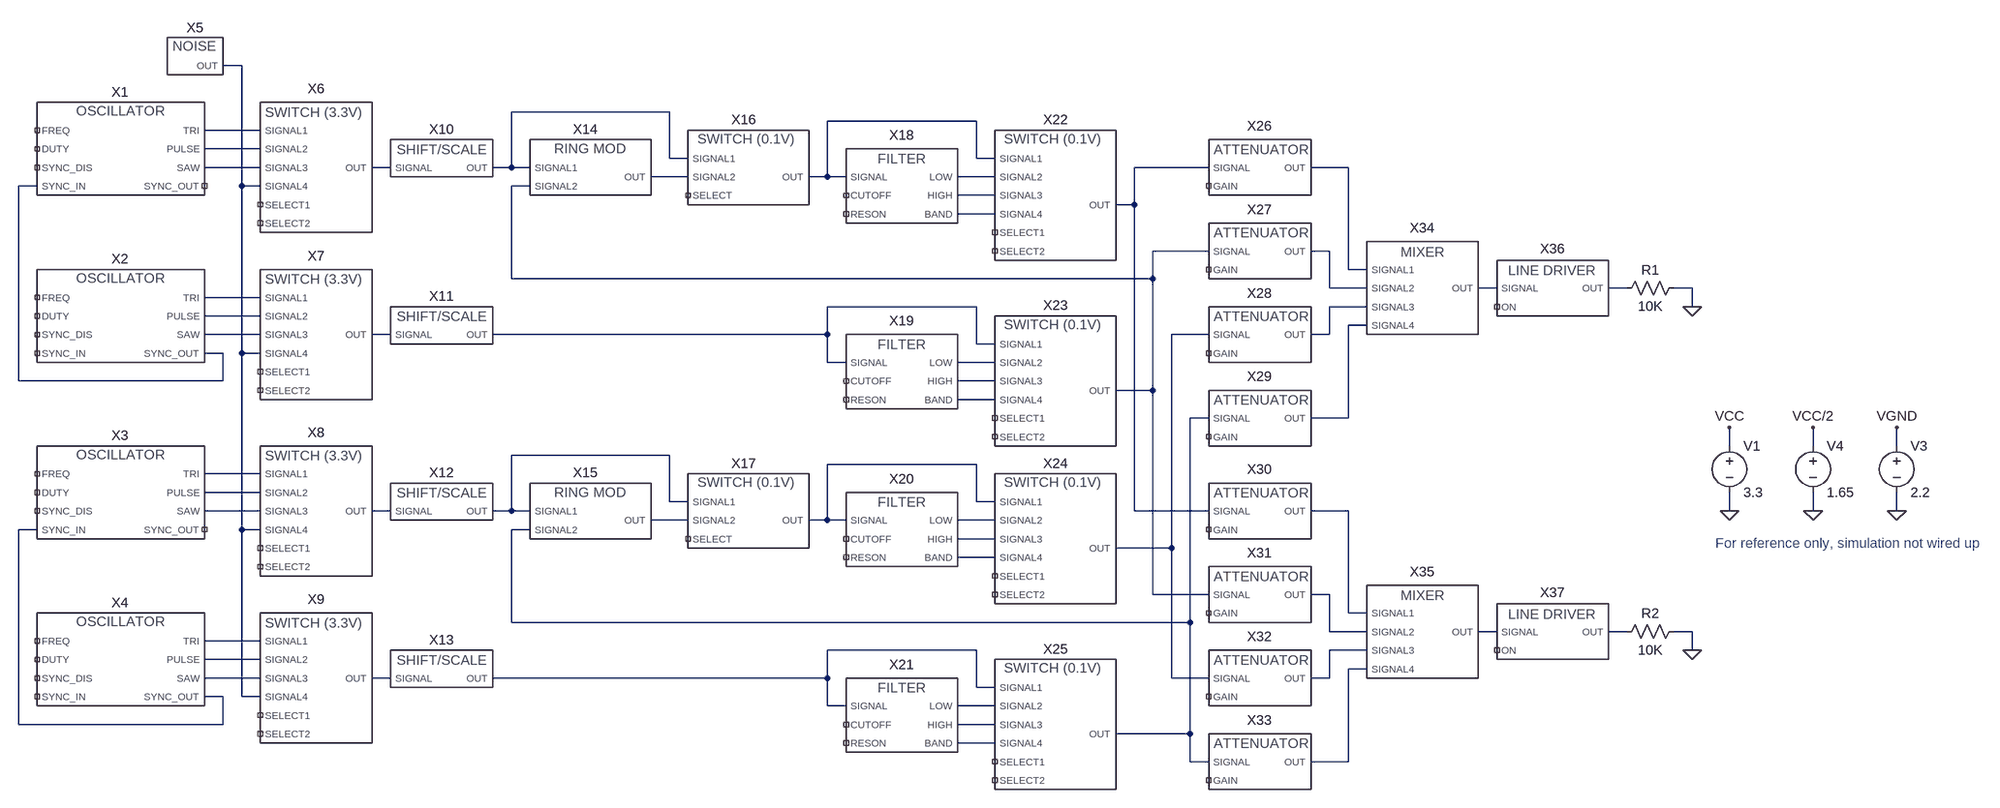
[diagram p0: schematic test_toplevel.asc]
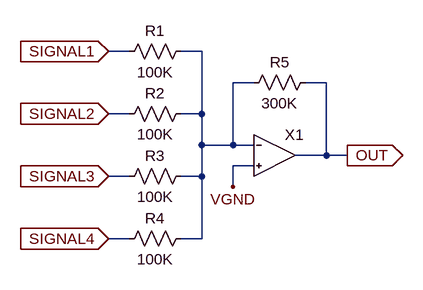
[diagram p1: sub-circuit mixer.asc]
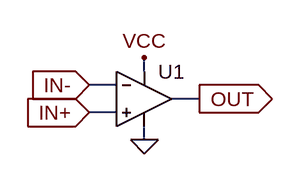
[diagram p2: sub-circuit opamp.asc]
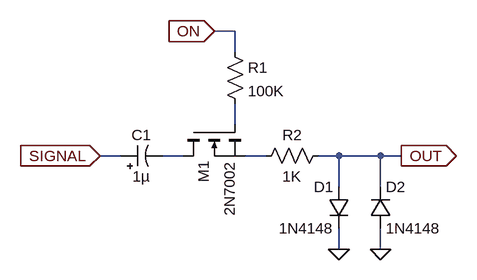
[diagram p3: sub-circuit line_driver.asc]
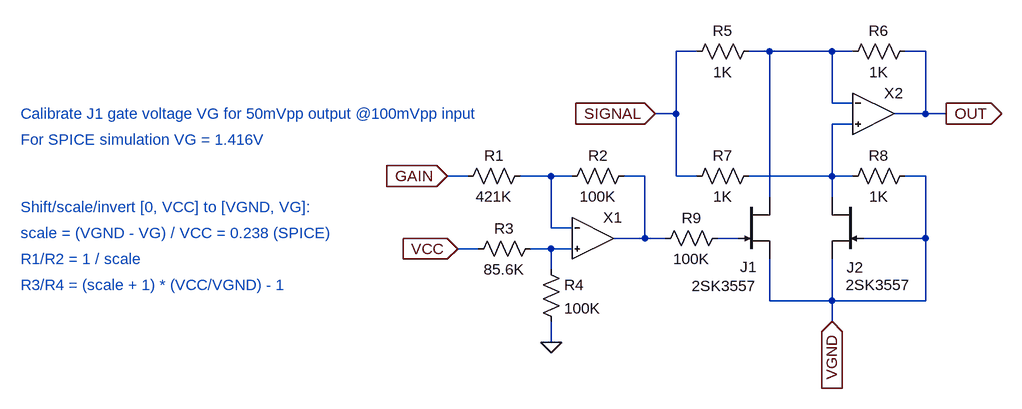
[diagram p4: sub-circuit attenuator.asc]
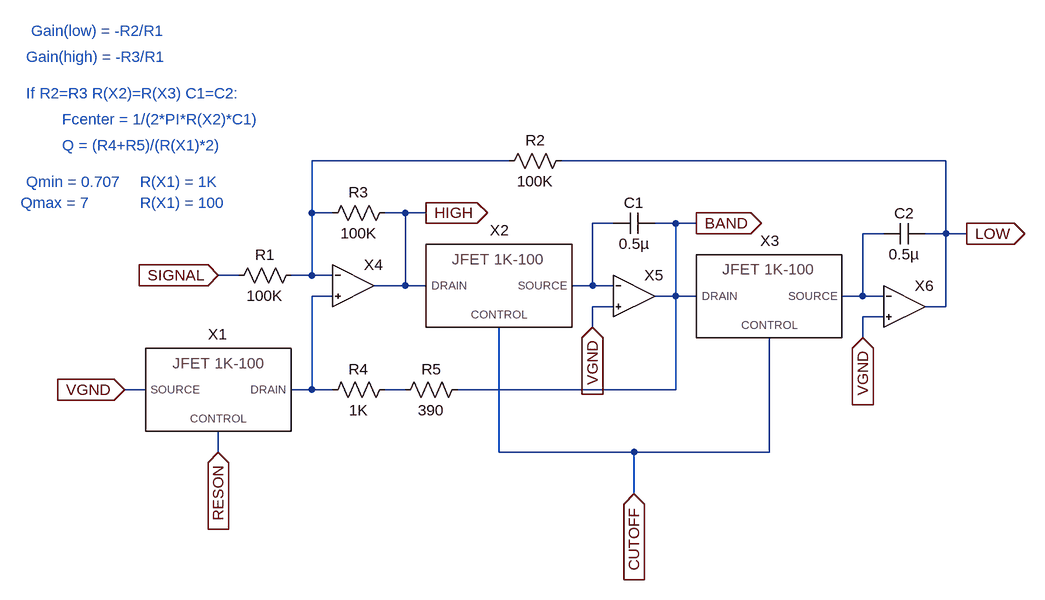
[diagram p5: sub-circuit filter.asc]
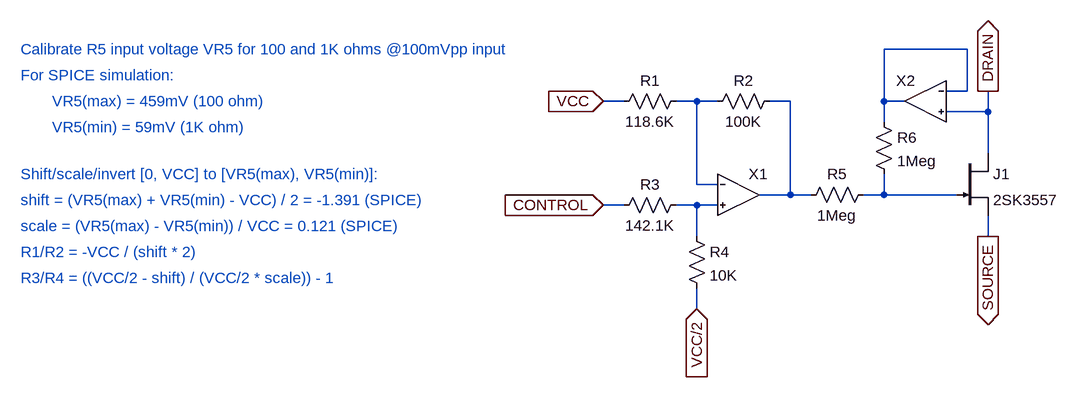
[diagram p6: sub-circuit jfet_1k_100.asc]
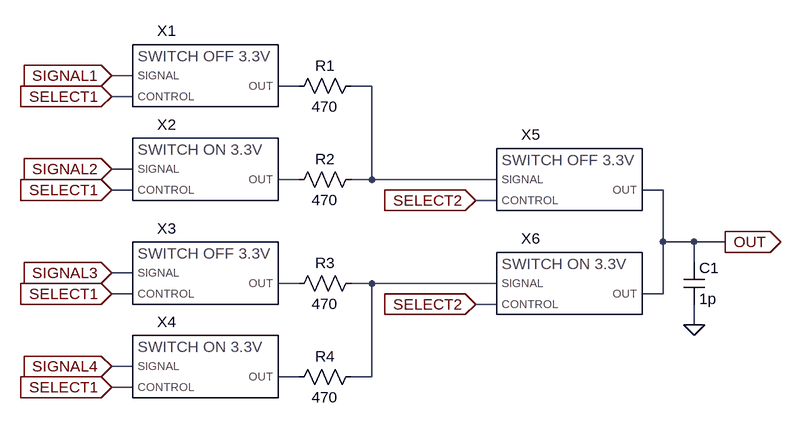
[diagram p7: sub-circuit switch4_3.3v.asc]
test_toplevel.asc, the LTspice schematic file:
Version 4
SHEET 1 1800 896
WIRE -1504 -624 -1536 -624
WIRE -768 -544 -1040 -544
WIRE -240 -528 -496 -528
WIRE -1472 -512 -1568 -512
WIRE -1472 -480 -1568 -480
WIRE -768 -464 -768 -544
WIRE -736 -464 -768 -464
WIRE -240 -464 -240 -528
WIRE -208 -464 -240 -464
WIRE -1472 -448 -1568 -448
WIRE -1248 -448 -1280 -448
WIRE -1040 -448 -1040 -544
WIRE -1040 -448 -1072 -448
WIRE -1008 -448 -1040 -448
WIRE 160 -448 32 -448
WIRE 400 -448 336 -448
WIRE -736 -432 -800 -432
WIRE -496 -432 -496 -528
WIRE -496 -432 -528 -432
WIRE -464 -432 -496 -432
WIRE -208 -432 -272 -432
WIRE -1856 -416 -1888 -416
WIRE -1504 -416 -1504 -624
WIRE -1472 -416 -1504 -416
WIRE -1008 -416 -1040 -416
WIRE -208 -400 -272 -400
WIRE 32 -384 32 -448
WIRE 32 -384 0 -384
WIRE -208 -368 -272 -368
WIRE 160 -304 64 -304
WIRE 368 -304 336 -304
WIRE 400 -272 400 -448
WIRE 432 -272 400 -272
WIRE -1040 -256 -1040 -416
WIRE 64 -256 64 -304
WIRE 64 -256 -1040 -256
WIRE 368 -240 368 -304
WIRE 432 -240 368 -240
WIRE 656 -240 624 -240
WIRE 880 -240 848 -240
WIRE 992 -240 960 -240
WIRE -1472 -224 -1568 -224
WIRE -240 -208 -496 -208
WIRE 432 -208 368 -208
WIRE 992 -208 992 -240
WIRE -1472 -192 -1568 -192
WIRE 432 -176 400 -176
WIRE -1472 -160 -1568 -160
WIRE -1248 -160 -1280 -160
WIRE -496 -160 -496 -208
WIRE -496 -160 -1072 -160
WIRE 160 -160 96 -160
WIRE 368 -160 368 -208
WIRE 368 -160 336 -160
WIRE -240 -144 -240 -208
WIRE -208 -144 -240 -144
WIRE -1536 -128 -1568 -128
WIRE -1504 -128 -1504 -416
WIRE -1472 -128 -1504 -128
WIRE -496 -112 -496 -160
WIRE -464 -112 -496 -112
WIRE -208 -112 -272 -112
WIRE -1888 -80 -1888 -416
WIRE -1536 -80 -1536 -128
WIRE -1536 -80 -1888 -80
WIRE -208 -80 -272 -80
WIRE 64 -64 64 -256
WIRE 64 -64 0 -64
WIRE -208 -48 -272 -48
WIRE 160 -16 128 -16
WIRE 400 -16 400 -176
WIRE 400 -16 336 -16
WIRE 1056 32 1056 0
WIRE 1200 32 1200 0
WIRE 1344 32 1344 0
WIRE -768 48 -1040 48
WIRE -240 64 -496 64
WIRE -1472 80 -1568 80
WIRE -1472 112 -1568 112
WIRE -768 128 -768 48
WIRE -736 128 -768 128
WIRE -240 128 -240 64
WIRE -208 128 -240 128
WIRE -1472 144 -1568 144
WIRE -1248 144 -1280 144
WIRE -1040 144 -1040 48
WIRE -1040 144 -1072 144
WIRE -1008 144 -1040 144
WIRE 32 144 32 -384
WIRE 160 144 32 144
WIRE 400 144 336 144
WIRE 1056 144 1056 112
WIRE 1200 144 1200 112
WIRE 1344 144 1344 112
WIRE -736 160 -800 160
WIRE -496 160 -496 64
WIRE -496 160 -528 160
WIRE -464 160 -496 160
WIRE -208 160 -272 160
WIRE -1856 176 -1888 176
WIRE -1504 176 -1504 -128
WIRE -1472 176 -1504 176
WIRE -1008 176 -1040 176
WIRE -208 192 -272 192
WIRE 96 208 96 -160
WIRE 96 208 0 208
WIRE -208 224 -272 224
WIRE 64 288 64 -64
WIRE 160 288 64 288
WIRE 368 288 336 288
WIRE 400 320 400 144
WIRE 432 320 400 320
WIRE -1040 336 -1040 176
WIRE 128 336 128 -16
WIRE 128 336 -1040 336
WIRE 368 352 368 288
WIRE 432 352 368 352
WIRE 656 352 624 352
WIRE 880 352 848 352
WIRE 992 352 960 352
WIRE -1472 368 -1568 368
WIRE -240 384 -496 384
WIRE 432 384 368 384
WIRE 992 384 992 352
WIRE -1472 400 -1568 400
WIRE 432 416 400 416
WIRE -1472 432 -1568 432
WIRE -1248 432 -1280 432
WIRE -496 432 -496 384
WIRE -496 432 -1072 432
WIRE 96 432 96 208
WIRE 160 432 96 432
WIRE 368 432 368 384
WIRE 368 432 336 432
WIRE -240 448 -240 384
WIRE -208 448 -240 448
WIRE -1536 464 -1568 464
WIRE -1504 464 -1504 176
WIRE -1472 464 -1504 464
WIRE -496 480 -496 432
WIRE -464 480 -496 480
WIRE -208 480 -272 480
WIRE -1888 512 -1888 176
WIRE -1536 512 -1536 464
WIRE -1536 512 -1888 512
WIRE -208 512 -272 512
WIRE 128 528 128 336
WIRE 128 528 0 528
WIRE -208 544 -272 544
WIRE 128 576 128 528
WIRE 160 576 128 576
WIRE 400 576 400 416
WIRE 400 576 336 576
FLAG 1056 144 0
FLAG 1056 0 VCC
FLAG 1344 144 0
FLAG 1344 0 VGND
FLAG 992 -208 0
FLAG 992 384 0
FLAG 1200 144 0
FLAG 1200 0 VCC/2
SYMBOL voltage 1056 16 R0
WINDOW 123 0 0 Left 0
WINDOW 39 0 0 Left 0
SYMATTR InstName V1
SYMATTR Value 3.3
SYMBOL voltage 1344 16 R0
WINDOW 123 0 0 Left 0
WINDOW 39 0 0 Left 0
SYMATTR InstName V3
SYMATTR Value 2.2
SYMBOL res 976 -256 R90
WINDOW 0 0 56 VBottom 2
WINDOW 3 32 56 VTop 2
SYMATTR InstName R1
SYMATTR Value 10K
SYMBOL mixer 528 -208 R0
SYMATTR InstName X34
SYMBOL res 976 336 R90
WINDOW 0 0 56 VBottom 2
WINDOW 3 32 56 VTop 2
SYMATTR InstName R2
SYMATTR Value 10K
SYMBOL line_driver 752 -272 R0
SYMATTR InstName X36
SYMBOL line_driver 752 320 R0
SYMATTR InstName X37
SYMBOL voltage 1200 16 R0
WINDOW 123 0 0 Left 0
WINDOW 39 0 0 Left 0
SYMATTR InstName V4
SYMATTR Value 1.65
SYMBOL attenuator 240 -464 R0
SYMATTR InstName X26
SYMBOL attenuator 240 -320 R0
SYMATTR InstName X27
SYMBOL attenuator 240 -176 R0
SYMATTR InstName X28
SYMBOL attenuator 240 -32 R0
SYMATTR InstName X29
SYMBOL mixer 528 384 R0
SYMATTR InstName X35
SYMBOL attenuator 240 128 R0
SYMATTR InstName X30
SYMBOL attenuator 240 272 R0
SYMATTR InstName X31
SYMBOL attenuator 240 416 R0
SYMATTR InstName X32
SYMBOL attenuator 240 560 R0
SYMATTR InstName X33
SYMBOL filter -368 -400 R0
SYMATTR InstName X18
SYMBOL filter -368 -80 R0
SYMATTR InstName X19
SYMBOL filter -368 192 R0
SYMATTR InstName X20
SYMBOL filter -368 512 R0
SYMATTR InstName X21
SYMBOL switch4_3.3v -1376 -480 R0
SYMATTR InstName X6
SYMBOL switch4_3.3v -1376 -192 R0
SYMATTR InstName X7
SYMBOL switch4_3.3v -1376 112 R0
SYMATTR InstName X8
SYMBOL switch4_3.3v -1376 400 R0
SYMATTR InstName X9
SYMBOL oscillator -1792 -512 R0
SYMATTR InstName X1
SYMBOL oscillator -1792 -224 R0
SYMATTR InstName X2
SYMBOL oscillator -1792 80 R0
SYMATTR InstName X3
SYMBOL oscillator -1792 368 R0
SYMATTR InstName X4
SYMBOL noise -1536 -624 R0
SYMATTR InstName X5
SYMBOL shift_scale -1184 -496 R0
SYMATTR InstName X10
SYMBOL shift_scale -1184 -208 R0
SYMATTR InstName X11
SYMBOL shift_scale -1184 96 R0
SYMATTR InstName X12
SYMBOL shift_scale -1184 384 R0
SYMATTR InstName X13
SYMBOL ring_modulator -992 -448 R0
SYMATTR InstName X14
SYMBOL ring_modulator -992 144 R0
SYMATTR InstName X15
SYMBOL switch2_0.1v -704 -464 R0
SYMATTR InstName X16
SYMBOL switch2_0.1v -704 128 R0
SYMATTR InstName X17
SYMBOL switch4_0.1v -176 -464 R0
SYMATTR InstName X22
SYMBOL switch4_0.1v -176 -144 R0
SYMATTR InstName X23
SYMBOL switch4_0.1v -176 128 R0
SYMATTR InstName X24
SYMBOL switch4_0.1v -176 448 R0
SYMATTR InstName X25
TEXT 1032 200 Left 2 ;For reference only, simulation not wired up

mixer.asc, the sub-circuit schematic file:
Version 4
SHEET 1 880 680
WIRE 128 16 96 16
WIRE 240 16 208 16
WIRE 320 64 288 64
WIRE 432 64 400 64
WIRE 128 112 96 112
WIRE 240 112 240 16
WIRE 240 112 208 112
WIRE 240 160 240 112
WIRE 288 160 288 64
WIRE 288 160 240 160
WIRE 320 160 288 160
WIRE 432 176 432 64
WIRE 432 176 384 176
WIRE 464 176 432 176
WIRE 320 192 288 192
WIRE 128 208 96 208
WIRE 240 208 240 160
WIRE 240 208 208 208
WIRE 288 224 288 192
WIRE 128 304 96 304
WIRE 240 304 240 208
WIRE 240 304 208 304
FLAG 96 16 SIGNAL1
IOPIN 96 16 In
FLAG 96 112 SIGNAL2
IOPIN 96 112 In
FLAG 96 208 SIGNAL3
IOPIN 96 208 In
FLAG 96 304 SIGNAL4
IOPIN 96 304 In
FLAG 288 224 VGND
FLAG 464 176 OUT
IOPIN 464 176 Out
SYMBOL res 224 0 R90
WINDOW 0 0 56 VBottom 2
WINDOW 3 32 56 VTop 2
SYMATTR InstName R1
SYMATTR Value 100K
SYMBOL res 224 96 R90
WINDOW 0 0 56 VBottom 2
WINDOW 3 32 56 VTop 2
SYMATTR InstName R2
SYMATTR Value 100K
SYMBOL res 224 192 R90
WINDOW 0 0 56 VBottom 2
WINDOW 3 32 56 VTop 2
SYMATTR InstName R3
SYMATTR Value 100K
SYMBOL res 224 288 R90
WINDOW 0 0 56 VBottom 2
WINDOW 3 32 56 VTop 2
SYMATTR InstName R4
SYMATTR Value 100K
SYMBOL opamp 352 176 R0
SYMATTR InstName X1
SYMBOL res 416 48 R90
WINDOW 0 0 56 VBottom 2
WINDOW 3 32 56 VTop 2
SYMATTR InstName R5
SYMATTR Value 300K

opamp.asc, the sub-circuit schematic file:
Version 4
SHEET 1 880 680
WIRE 144 144 144 128
WIRE 112 160 80 160
WIRE 208 176 176 176
WIRE 112 192 80 192
WIRE 144 224 144 208
FLAG 144 224 0
FLAG 144 128 VCC
FLAG 208 176 OUT
IOPIN 208 176 Out
FLAG 80 192 IN+
IOPIN 80 192 In
FLAG 80 160 IN-
IOPIN 80 160 In
SYMBOL Opamps\\UniversalOpamp2 144 176 R0
SYMATTR InstName U1
SYMATTR Value2 Avol=1Meg GBW=1.2Meg Slew=10Meg

line_driver.asc, the sub-circuit schematic file:
Version 4
SHEET 1 880 680
WIRE -16 -80 -48 -80
WIRE -16 -48 -16 -80
WIRE -16 64 -16 32
WIRE -192 112 -224 112
WIRE -96 112 -128 112
WIRE 32 112 0 112
WIRE 144 112 112 112
WIRE 208 112 144 112
WIRE 240 112 208 112
WIRE 144 160 144 112
WIRE 208 160 208 112
WIRE 144 256 144 224
WIRE 208 256 208 224
FLAG 144 256 0
FLAG 208 256 0
FLAG 240 112 OUT
IOPIN 240 112 Out
FLAG -224 112 SIGNAL
IOPIN -224 112 In
FLAG -48 -80 ON
IOPIN -48 -80 In
SYMBOL res 128 96 R90
WINDOW 0 0 56 VBottom 2
WINDOW 3 32 56 VTop 2
SYMATTR InstName R2
SYMATTR Value 1K
SYMBOL diode 160 160 M0
SYMATTR InstName D1
SYMATTR Value 1N4148
SYMBOL diode 192 224 M180
WINDOW 0 24 64 Left 2
WINDOW 3 24 0 Left 2
SYMATTR InstName D2
SYMATTR Value 1N4148
SYMBOL polcap -192 128 R270
WINDOW 0 32 32 VTop 2
WINDOW 3 0 32 VBottom 2
SYMATTR InstName C1
SYMATTR Value 1µ
SYMBOL res -32 -64 R0
SYMATTR InstName R1
SYMATTR Value 100K
SYMBOL nmos -96 64 M90
SYMATTR InstName M1
SYMATTR Value 2N7002

attenuator.asc, the sub-circuit schematic file:
Version 4
SHEET 1 1100 728
WIRE -96 80 -128 80
WIRE 16 80 -16 80
WIRE 112 80 16 80
WIRE 144 80 112 80
WIRE 256 80 224 80
WIRE 112 160 112 80
WIRE 144 160 112 160
WIRE -128 176 -128 80
WIRE -128 176 -160 176
WIRE 256 176 256 80
WIRE 256 176 208 176
WIRE 288 176 256 176
WIRE 144 192 112 192
WIRE -448 272 -480 272
WIRE -320 272 -368 272
WIRE -288 272 -320 272
WIRE -176 272 -208 272
WIRE -128 272 -128 176
WIRE -96 272 -128 272
WIRE 112 272 112 192
WIRE 112 272 -16 272
WIRE 144 272 112 272
WIRE 256 272 224 272
WIRE 16 304 16 80
WIRE 112 304 112 272
WIRE -320 352 -320 272
WIRE -288 352 -320 352
WIRE -176 368 -176 272
WIRE -176 368 -224 368
WIRE -144 368 -176 368
WIRE -32 368 -64 368
WIRE 256 368 256 272
WIRE 256 368 160 368
WIRE -432 384 -464 384
WIRE -320 384 -352 384
WIRE -288 384 -320 384
WIRE -320 416 -320 384
WIRE 16 464 16 400
WIRE 112 464 112 400
WIRE 112 464 16 464
WIRE 256 464 256 368
WIRE 256 464 112 464
WIRE 112 496 112 464
WIRE -320 528 -320 496
FLAG 288 176 OUT
IOPIN 288 176 Out
FLAG -160 176 SIGNAL
IOPIN -160 176 In
FLAG -320 528 0
FLAG -480 272 GAIN
IOPIN -480 272 In
FLAG 112 496 VGND
IOPIN 112 496 In
FLAG -464 384 VCC
IOPIN -464 384 In
SYMBOL res 240 64 R90
WINDOW 0 0 56 VBottom 2
WINDOW 3 32 56 VTop 2
SYMATTR InstName R6
SYMATTR Value 1K
SYMBOL res 240 256 R90
WINDOW 0 0 56 VBottom 2
WINDOW 3 32 56 VTop 2
SYMATTR InstName R8
SYMATTR Value 1K
SYMBOL njf 160 304 M0
WINDOW 0 0 109 Left 2
WINDOW 3 -72 136 Left 2
SYMATTR InstName J2
SYMATTR Value 2SK3557
SYMBOL njf -32 304 R0
WINDOW 0 3 108 Left 2
WINDOW 3 -72 137 Left 2
SYMATTR InstName J1
SYMATTR Value 2SK3557
SYMBOL res 0 64 R90
WINDOW 0 0 56 VBottom 2
WINDOW 3 32 56 VTop 2
SYMATTR InstName R5
SYMATTR Value 1K
SYMBOL res 0 256 R90
WINDOW 0 0 56 VBottom 2
WINDOW 3 32 56 VTop 2
SYMATTR InstName R7
SYMATTR Value 1K
SYMBOL res -48 352 R90
WINDOW 0 0 56 VBottom 2
WINDOW 3 32 56 VTop 2
SYMATTR InstName R9
SYMATTR Value 100K
SYMBOL res -336 400 R0
SYMATTR InstName R4
SYMATTR Value 100K
SYMBOL res -336 368 R90
WINDOW 0 0 56 VBottom 2
WINDOW 3 32 56 VTop 2
SYMATTR InstName R3
SYMATTR Value 85.6K
SYMBOL res -192 256 R90
WINDOW 0 0 56 VBottom 2
WINDOW 3 32 56 VTop 2
SYMATTR InstName R2
SYMATTR Value 100K
SYMBOL res -352 256 R90
WINDOW 0 0 56 VBottom 2
WINDOW 3 32 56 VTop 2
SYMATTR InstName R1
SYMATTR Value 421K
SYMBOL opamp 176 176 R0
SYMATTR InstName X2
SYMBOL opamp -256 368 R0
SYMATTR InstName X1
TEXT -1136 176 Left 2 ;Calibrate J1 gate voltage VG for 50mVpp output @100mVpp input
TEXT -1136 320 Left 2 ;Shift/scale/invert [0, VCC] to [VGND, VG]:
TEXT -1136 216 Left 2 ;For SPICE simulation VG = 1.416V
TEXT -1136 360 Left 2 ;scale = (VGND - VG) / VCC = 0.238 (SPICE)
TEXT -1136 400 Left 2 ;R1/R2 = 1 / scale
TEXT -1136 440 Left 2 ;R3/R4 = (scale + 1) * (VCC/VGND) - 1

filter.asc, the sub-circuit schematic file:
Version 4
SHEET 1 1624 1400
WIRE 96 48 -208 48
WIRE 768 48 176 48
WIRE -208 128 -208 48
WIRE -176 128 -208 128
WIRE -64 128 -96 128
WIRE -32 128 -64 128
WIRE 256 144 224 144
WIRE 352 144 320 144
WIRE 384 144 352 144
WIRE 672 160 640 160
WIRE 768 160 768 48
WIRE 768 160 736 160
WIRE 800 160 768 160
WIRE -320 224 -352 224
WIRE -208 224 -208 128
WIRE -208 224 -240 224
WIRE -176 224 -208 224
WIRE -64 240 -64 128
WIRE -64 240 -112 240
WIRE -32 240 -64 240
WIRE 224 240 224 144
WIRE 224 240 192 240
WIRE 256 240 224 240
WIRE -176 256 -208 256
WIRE 352 256 352 144
WIRE 352 256 320 256
WIRE 384 256 352 256
WIRE 640 256 640 160
WIRE 640 256 608 256
WIRE 672 256 640 256
WIRE 256 272 224 272
WIRE 768 272 768 160
WIRE 768 272 736 272
WIRE 672 288 640 288
WIRE 224 304 224 272
WIRE 640 320 640 288
WIRE -464 400 -496 400
WIRE -208 400 -208 256
WIRE -208 400 -240 400
WIRE -176 400 -208 400
WIRE -64 400 -96 400
WIRE 352 400 352 256
WIRE 352 400 16 400
WIRE -352 496 -352 464
WIRE 80 496 80 304
WIRE 288 496 80 496
WIRE 496 496 496 320
WIRE 496 496 288 496
WIRE 288 560 288 496
FLAG -352 224 SIGNAL
IOPIN -352 224 In
FLAG 224 304 VGND
IOPIN 224 304 In
FLAG 640 320 VGND
IOPIN 640 320 In
FLAG -32 128 HIGH
IOPIN -32 128 Out
FLAG 384 144 BAND
IOPIN 384 144 Out
FLAG 800 160 LOW
IOPIN 800 160 Out
FLAG -496 400 VGND
IOPIN -496 400 In
FLAG -352 496 RESON
IOPIN -352 496 In
FLAG 288 560 CUTOFF
IOPIN 288 560 In
SYMBOL cap 320 128 R90
WINDOW 0 0 32 VBottom 2
WINDOW 3 32 32 VTop 2
SYMATTR InstName C1
SYMATTR Value 0.5µ
SYMBOL cap 736 144 R90
WINDOW 0 0 32 VBottom 2
WINDOW 3 32 32 VTop 2
SYMATTR InstName C2
SYMATTR Value 0.5µ
SYMBOL res -80 112 R90
WINDOW 0 0 56 VBottom 2
WINDOW 3 32 56 VTop 2
SYMATTR InstName R3
SYMATTR Value 100K
SYMBOL res 192 32 R90
WINDOW 0 0 56 VBottom 2
WINDOW 3 32 56 VTop 2
SYMATTR InstName R2
SYMATTR Value 100K
SYMBOL res -224 208 R90
WINDOW 0 0 56 VBottom 2
WINDOW 3 32 56 VTop 2
SYMATTR InstName R1
SYMATTR Value 100K
SYMBOL opamp -144 240 R0
SYMATTR InstName X4
SYMBOL opamp 288 256 R0
SYMATTR InstName X5
SYMBOL opamp 704 272 R0
SYMATTR InstName X6
SYMBOL res -80 384 R90
WINDOW 0 0 56 VBottom 2
WINDOW 3 32 56 VTop 2
SYMATTR InstName R4
SYMATTR Value 1K
SYMBOL jfet_1k_100 -352 400 M0
SYMATTR InstName X1
SYMBOL jfet_1k_100 80 240 R0
SYMATTR InstName X2
SYMBOL jfet_1k_100 496 256 R0
SYMATTR InstName X3
SYMBOL res 32 384 R90
WINDOW 0 0 56 VBottom 2
WINDOW 3 32 56 VTop 2
SYMATTR InstName R5
SYMATTR Value 390
TEXT -640 -152 Left 2 ;Gain(low) = -R2/R1
TEXT -648 -112 Left 2 ;Gain(high) = -R3/R1
TEXT -648 -56 Left 2 ;If R2=R3 R(X2)=R(X3) C1=C2:
TEXT -592 -16 Left 2 ;Fcenter = 1/(2*PI*R(X2)*C1)
TEXT -592 24 Left 2 ;Q = (R4+R5)/(R(X1)*2)
TEXT -648 80 Left 2 ;Qmin = 0.707
TEXT -656 112 Left 2 ;Qmax = 7
TEXT -472 80 Left 2 ;R(X1) = 1K
TEXT -472 112 Left 2 ;R(X1) = 100

jfet_1k_100.asc, the sub-circuit schematic file:
Version 4
SHEET 1 1080 680
WIRE 352 -256 224 -256
WIRE 352 -192 352 -256
WIRE 352 -192 320 -192
WIRE -176 -176 -208 -176
WIRE -64 -176 -96 -176
WIRE -32 -176 -64 -176
WIRE 80 -176 48 -176
WIRE 224 -176 224 -256
WIRE 256 -176 224 -176
WIRE 384 -160 384 -192
WIRE 384 -160 320 -160
WIRE 224 -144 224 -176
WIRE 384 -96 384 -160
WIRE -64 -48 -64 -176
WIRE -32 -48 -64 -48
WIRE 80 -32 80 -176
WIRE 80 -32 32 -32
WIRE 112 -32 80 -32
WIRE 224 -32 224 -64
WIRE 224 -32 192 -32
WIRE 336 -32 224 -32
WIRE -176 -16 -208 -16
WIRE -64 -16 -96 -16
WIRE -32 -16 -64 -16
WIRE -64 32 -64 -16
WIRE 384 32 384 0
WIRE -64 144 -64 112
FLAG -208 -16 CONTROL
IOPIN -208 -16 In
FLAG 384 32 SOURCE
IOPIN 384 32 Out
FLAG 384 -192 DRAIN
IOPIN 384 -192 Out
FLAG -208 -176 VCC
IOPIN -208 -176 In
FLAG -64 144 VCC/2
IOPIN -64 144 In
SYMBOL res -80 -192 R90
WINDOW 0 0 56 VBottom 2
WINDOW 3 32 56 VTop 2
SYMATTR InstName R1
SYMATTR Value 118.6K
SYMBOL res 64 -192 R90
WINDOW 0 0 56 VBottom 2
WINDOW 3 32 56 VTop 2
SYMATTR InstName R2
SYMATTR Value 100K
SYMBOL res -80 -32 R90
WINDOW 0 0 56 VBottom 2
WINDOW 3 32 56 VTop 2
SYMATTR InstName R3
SYMATTR Value 142.1K
SYMBOL res -80 16 R0
SYMATTR InstName R4
SYMATTR Value 10K
SYMBOL res 208 -48 R90
WINDOW 0 0 56 VBottom 2
WINDOW 3 32 56 VTop 2
SYMATTR InstName R5
SYMATTR Value 1Meg
SYMBOL njf 336 -96 R0
SYMATTR InstName J1
SYMATTR Value 2SK3557
SYMBOL res 208 -160 R0
SYMATTR InstName R6
SYMATTR Value 1Meg
SYMBOL opamp 0 -32 R0
SYMATTR InstName X1
SYMBOL opamp 288 -176 M0
SYMATTR InstName X2
TEXT -1104 -256 Left 2 ;Calibrate R5 input voltage VR5 for 100 and 1K ohms @100mVpp input
TEXT -1104 -216 Left 2 ;For SPICE simulation:
TEXT -1104 -24 Left 2 ;shift = (VR5(max) + VR5(min) - VCC) / 2 = -1.391 (SPICE)
TEXT -1104 -64 Left 2 ;Shift/scale/invert [0, VCC] to [VR5(max), VR5(min)]:
TEXT -1104 16 Left 2 ;scale = (VR5(max) - VR5(min)) / VCC = 0.121 (SPICE)
TEXT -1104 56 Left 2 ;R1/R2 = -VCC / (shift * 2)
TEXT -1104 96 Left 2 ;R3/R4 = ((VCC/2 - shift) / (VCC/2 * scale)) - 1
TEXT -1056 -176 Left 2 ;VR5(max) = 459mV (100 ohm)
TEXT -1056 -136 Left 2 ;VR5(min) = 59mV (1K ohm)

switch4_3.3v.asc, the sub-circuit schematic file:
Version 4
SHEET 1 1148 712
WIRE 80 160 48 160
WIRE 336 176 304 176
WIRE 448 176 416 176
WIRE 80 192 48 192
WIRE 80 304 48 304
WIRE 336 320 304 320
WIRE 448 320 448 176
WIRE 448 320 416 320
WIRE 640 320 448 320
WIRE 80 336 48 336
WIRE 896 336 864 336
WIRE 640 352 608 352
WIRE 896 416 896 336
WIRE 944 416 896 416
WIRE 992 416 944 416
WIRE 944 448 944 416
WIRE 80 464 48 464
WIRE 336 480 304 480
WIRE 448 480 416 480
WIRE 640 480 448 480
WIRE 80 496 48 496
WIRE 896 496 896 416
WIRE 896 496 864 496
WIRE 640 512 608 512
WIRE 944 544 944 512
WIRE 80 608 48 608
WIRE 336 624 304 624
WIRE 448 624 448 480
WIRE 448 624 416 624
WIRE 80 640 48 640
FLAG 48 160 SIGNAL1
IOPIN 48 160 In
FLAG 48 304 SIGNAL2
IOPIN 48 304 In
FLAG 48 464 SIGNAL3
IOPIN 48 464 In
FLAG 48 608 SIGNAL4
IOPIN 48 608 In
FLAG 48 192 SELECT1
IOPIN 48 192 In
FLAG 48 336 SELECT1
IOPIN 48 336 In
FLAG 48 496 SELECT1
IOPIN 48 496 In
FLAG 48 640 SELECT1
IOPIN 48 640 In
FLAG 608 352 SELECT2
IOPIN 608 352 In
FLAG 608 512 SELECT2
IOPIN 608 512 In
FLAG 992 416 OUT
IOPIN 992 416 Out
FLAG 944 544 0
SYMBOL res 432 160 R90
WINDOW 0 0 56 VBottom 2
WINDOW 3 32 56 VTop 2
SYMATTR InstName R1
SYMATTR Value 470
SYMBOL res 432 304 R90
WINDOW 0 0 56 VBottom 2
WINDOW 3 32 56 VTop 2
SYMATTR InstName R2
SYMATTR Value 470
SYMBOL res 432 464 R90
WINDOW 0 0 56 VBottom 2
WINDOW 3 32 56 VTop 2
SYMATTR InstName R3
SYMATTR Value 470
SYMBOL res 432 608 R90
WINDOW 0 0 56 VBottom 2
WINDOW 3 32 56 VTop 2
SYMATTR InstName R4
SYMATTR Value 470
SYMBOL switch_off_3.3v 128 192 R0
SYMATTR InstName X1
SYMBOL switch_on_3.3v 128 336 R0
SYMATTR InstName X2
SYMBOL switch_off_3.3v 128 496 R0
SYMATTR InstName X3
SYMBOL switch_on_3.3v 128 640 R0
SYMATTR InstName X4
SYMBOL switch_off_3.3v 688 352 R0
SYMATTR InstName X5
SYMBOL switch_on_3.3v 688 512 R0
SYMATTR InstName X6
SYMBOL cap 928 448 R0
SYMATTR InstName C1
SYMATTR Value 1p

switch_off_3.3v.asc, the sub-circuit schematic file:
Version 4
SHEET 1 2264 680
WIRE 416 160 416 128
WIRE 656 192 656 160
WIRE 656 192 624 192
WIRE 688 192 656 192
WIRE 624 224 624 192
WIRE 688 224 688 192
WIRE 416 272 416 240
WIRE 448 272 416 272
WIRE 560 272 528 272
WIRE 784 272 752 272
WIRE 896 272 864 272
WIRE 416 304 416 272
WIRE 240 352 208 352
WIRE 352 352 320 352
WIRE 624 352 624 320
WIRE 656 352 624 352
WIRE 688 352 688 320
WIRE 688 352 656 352
WIRE 656 384 656 352
WIRE 416 432 416 400
FLAG 416 128 VCC
FLAG 416 432 0
FLAG 656 384 SIGNAL
IOPIN 656 384 In
FLAG 896 272 CONTROL
IOPIN 896 272 In
FLAG 208 352 CONTROL
IOPIN 208 352 In
FLAG 656 160 OUT
IOPIN 656 160 Out
SYMBOL res 432 256 R180
WINDOW 0 36 76 Left 2
WINDOW 3 36 40 Left 2
SYMATTR InstName R2
SYMATTR Value 100K
SYMBOL npn 352 304 R0
WINDOW 0 56 29 Left 2
WINDOW 3 56 64 Left 2
SYMATTR InstName Q1
SYMATTR Value 2N3904
SYMBOL res 336 336 R90
WINDOW 0 0 56 VBottom 2
WINDOW 3 32 56 VTop 2
SYMATTR InstName R1
SYMATTR Value 100K
SYMBOL npn 560 224 R0
WINDOW 0 20 -41 Left 2
WINDOW 3 -34 -10 Left 2
SYMATTR InstName Q2
SYMATTR Value 2N3904
SYMBOL pnp 752 224 M0
WINDOW 0 21 -40 Left 2
WINDOW 3 -32 -11 Left 2
SYMATTR InstName Q3
SYMATTR Value 2N3906
SYMBOL res 768 288 R270
WINDOW 0 32 56 VTop 2
WINDOW 3 0 56 VBottom 2
SYMATTR InstName R4
SYMATTR Value 100K
SYMBOL res 544 256 R90
WINDOW 0 0 56 VBottom 2
WINDOW 3 32 56 VTop 2
SYMATTR InstName R3
SYMATTR Value 100K

switch_on_3.3v.asc, the sub-circuit schematic file:
Version 4
SHEET 1 2264 680
WIRE 416 -304 416 -336
WIRE 240 -256 208 -256
WIRE 352 -256 320 -256
WIRE 656 -256 656 -288
WIRE 656 -256 624 -256
WIRE 688 -256 656 -256
WIRE 624 -224 624 -256
WIRE 688 -224 688 -256
WIRE 416 -176 416 -208
WIRE 448 -176 416 -176
WIRE 560 -176 528 -176
WIRE 784 -176 752 -176
WIRE 896 -176 864 -176
WIRE 416 -144 416 -176
WIRE 624 -96 624 -128
WIRE 656 -96 624 -96
WIRE 688 -96 688 -128
WIRE 688 -96 656 -96
WIRE 656 -64 656 -96
WIRE 416 -32 416 -64
FLAG 896 -176 CONTROL
IOPIN 896 -176 In
FLAG 656 -288 SIGNAL
IOPIN 656 -288 In
FLAG 416 -336 VCC
FLAG 416 -32 0
FLAG 208 -256 CONTROL
IOPIN 208 -256 In
FLAG 656 -64 OUT
IOPIN 656 -64 Out
SYMBOL npn 752 -128 R180
WINDOW 0 17 -13 Left 2
WINDOW 3 -43 -44 Left 2
SYMATTR InstName Q3
SYMATTR Value 2N3904
SYMBOL res 880 -192 R90
WINDOW 0 0 56 VBottom 2
WINDOW 3 32 56 VTop 2
SYMATTR InstName R4
SYMATTR Value 100K
SYMBOL pnp 560 -128 M180
WINDOW 0 18 -14 Left 2
WINDOW 3 -39 -45 Left 2
SYMATTR InstName Q2
SYMATTR Value 2N3906
SYMBOL res 432 -48 R180
WINDOW 0 36 76 Left 2
WINDOW 3 36 40 Left 2
SYMATTR InstName R2
SYMATTR Value 100K
SYMBOL res 336 -272 R90
WINDOW 0 0 56 VBottom 2
WINDOW 3 32 56 VTop 2
SYMATTR InstName R1
SYMATTR Value 100K
SYMBOL pnp 352 -208 M180
WINDOW 0 63 66 Left 2
WINDOW 3 62 31 Left 2
SYMATTR InstName Q1
SYMATTR Value 2N3906
SYMBOL res 544 -192 R90
WINDOW 0 0 56 VBottom 2
WINDOW 3 32 56 VTop 2
SYMATTR InstName R3
SYMATTR Value 100K

oscillator.asc, the sub-circuit schematic file:
Version 4
SHEET 1 1312 680
WIRE -1344 -544 -1376 -544
WIRE -1232 -544 -1264 -544
WIRE -1200 -544 -1232 -544
WIRE -1088 -544 -1120 -544
WIRE -768 -544 -1088 -544
WIRE -640 -544 -768 -544
WIRE -640 -480 -640 -544
WIRE -640 -480 -672 -480
WIRE -768 -464 -768 -544
WIRE -736 -464 -768 -464
WIRE -640 -448 -672 -448
WIRE -608 -448 -640 -448
WIRE -496 -448 -528 -448
WIRE -1232 -432 -1232 -544
WIRE -1232 -432 -1264 -432
WIRE -1376 -416 -1376 -544
WIRE -1376 -416 -1408 -416
WIRE -1328 -416 -1376 -416
WIRE -640 -416 -640 -448
WIRE -1232 -400 -1264 -400
WIRE -1200 -400 -1232 -400
WIRE -1088 -400 -1088 -544
WIRE -1088 -400 -1120 -400
WIRE -992 -384 -1024 -384
WIRE -400 -352 -400 -384
WIRE -1232 -336 -1232 -400
WIRE -640 -304 -640 -336
WIRE -640 -304 -912 -304
WIRE -608 -304 -640 -304
WIRE -1136 -288 -1168 -288
WIRE -1024 -288 -1024 -384
WIRE -1024 -288 -1056 -288
WIRE -976 -288 -1024 -288
WIRE -880 -272 -912 -272
WIRE -400 -240 -400 -272
WIRE -368 -240 -400 -240
WIRE -256 -240 -288 -240
WIRE -1232 -208 -1232 -240
WIRE -256 -208 -256 -240
WIRE -1024 -192 -1024 -288
WIRE -992 -192 -1024 -192
WIRE -880 -192 -880 -272
WIRE -880 -192 -912 -192
WIRE -848 -192 -880 -192
WIRE -736 -192 -768 -192
WIRE -400 -176 -400 -240
WIRE -400 -176 -432 -176
WIRE -1024 -160 -1024 -192
WIRE -608 -160 -720 -160
WIRE -496 -160 -528 -160
WIRE -400 -144 -432 -144
WIRE -272 -144 -400 -144
WIRE -240 -144 -272 -144
WIRE -144 -144 -176 -144
WIRE -720 -128 -720 -160
WIRE -400 -112 -400 -144
WIRE -272 -80 -272 -144
WIRE -1024 -64 -1024 -80
WIRE -768 -64 -800 -64
WIRE -640 -64 -640 -304
WIRE -640 -64 -672 -64
WIRE -176 -32 -208 -32
WIRE -64 -32 -96 -32
WIRE -1040 -16 -1072 -16
WIRE -912 -16 -944 -16
WIRE -800 -16 -800 -64
WIRE -800 -16 -832 -16
WIRE -752 -16 -800 -16
WIRE -640 -16 -640 -64
WIRE -640 -16 -688 -16
WIRE -400 0 -400 -32
WIRE -1072 16 -1072 -16
WIRE -272 48 -272 16
WIRE -1056 112 -1088 112
WIRE -1024 112 -1056 112
WIRE -912 112 -944 112
WIRE -800 112 -800 -16
WIRE -800 112 -832 112
WIRE -768 112 -800 112
WIRE -640 128 -640 -16
WIRE -640 128 -704 128
WIRE -576 128 -640 128
WIRE -768 144 -800 144
WIRE -480 144 -512 144
WIRE -448 144 -480 144
WIRE -576 160 -608 160
WIRE -480 176 -480 144
WIRE -1056 224 -1056 112
WIRE -912 224 -1056 224
WIRE -800 224 -800 144
WIRE -800 224 -832 224
WIRE -800 256 -800 224
WIRE -608 288 -608 160
WIRE -480 288 -480 256
WIRE -480 288 -608 288
WIRE -608 320 -608 288
WIRE -480 320 -480 288
WIRE -800 368 -800 336
WIRE -608 432 -608 400
WIRE -480 432 -480 400
FLAG -736 -192 VCC/2
FLAG -1088 112 FREQ
IOPIN -1088 112 In
FLAG -480 432 DUTY
IOPIN -480 432 In
FLAG -800 368 0
FLAG -1072 16 0
FLAG -608 -304 TRI
IOPIN -608 -304 Out
FLAG -448 144 PULSE
IOPIN -448 144 Out
FLAG -608 432 VCC/2
FLAG -496 -448 VCC
FLAG -1408 -416 SAW
IOPIN -1408 -416 Out
FLAG -1232 -208 VCC/2_COMP
FLAG -992 -384 SYNC_OUT
IOPIN -992 -384 Out
FLAG -64 -32 SYNC_DIS
IOPIN -64 -32 In
FLAG -400 0 0
FLAG -144 -144 SYNC_IN
IOPIN -144 -144 In
FLAG -256 -208 0
FLAG -400 -384 VCC
FLAG -272 48 0
SYMBOL res -928 128 R270
WINDOW 0 32 56 VTop 2
WINDOW 3 0 56 VBottom 2
SYMATTR InstName R2
SYMATTR Value 56K
SYMBOL res -896 -208 R90
WINDOW 0 0 56 VBottom 2
WINDOW 3 32 56 VTop 2
SYMATTR InstName R6
SYMATTR Value 2.2K
SYMBOL res -752 -208 R90
WINDOW 0 0 56 VBottom 2
WINDOW 3 32 56 VTop 2
SYMATTR InstName R7
SYMATTR Value 100K
SYMBOL res -816 -32 R90
WINDOW 0 0 56 VBottom 2
WINDOW 3 32 56 VTop 2
SYMATTR InstName R3
SYMATTR Value 56K
SYMBOL cap -688 -32 R90
WINDOW 0 0 32 VBottom 2
WINDOW 3 32 32 VTop 2
SYMATTR InstName C1
SYMATTR Value 1n
SYMBOL res -816 240 R0
SYMATTR InstName R5
SYMATTR Value 100K
SYMBOL res -928 240 R270
WINDOW 0 32 56 VTop 2
WINDOW 3 0 56 VBottom 2
SYMATTR InstName R4
SYMATTR Value 100K
SYMBOL nmos -944 -64 R90
WINDOW 0 68 33 VRight 2
WINDOW 3 95 6 VRight 2
SYMATTR InstName M1
SYMATTR Value 2N7002
SYMBOL res -496 304 R0
SYMATTR InstName R21
SYMATTR Value 4.7K
SYMBOL res -592 416 R180
WINDOW 0 36 76 Left 2
WINDOW 3 36 40 Left 2
SYMATTR InstName R20
SYMATTR Value 100K
SYMBOL res -1008 -64 R180
WINDOW 0 36 76 Left 2
WINDOW 3 36 40 Left 2
SYMATTR InstName R8
SYMATTR Value 4.7K
SYMBOL res -496 160 R0
SYMATTR InstName R22
SYMATTR Value 1Meg
SYMBOL res -1040 128 R270
WINDOW 0 32 56 VTop 2
WINDOW 3 0 56 VBottom 2
SYMATTR InstName R1
SYMATTR Value 56K
SYMBOL opamp -944 -288 M0
SYMATTR InstName X2
SYMBOL opamp -544 144 R0
SYMATTR InstName X6
SYMBOL opamp -736 128 R0
SYMATTR InstName X1
SYMBOL res -1248 -560 R90
WINDOW 0 0 56 VBottom 2
WINDOW 3 32 56 VTop 2
SYMATTR InstName R17
SYMATTR Value 100K
SYMBOL res -1104 -560 R90
WINDOW 0 0 56 VBottom 2
WINDOW 3 32 56 VTop 2
SYMATTR InstName R16
SYMATTR Value 100K
SYMBOL res -1104 -416 R90
WINDOW 0 0 56 VBottom 2
WINDOW 3 32 56 VTop 2
SYMATTR InstName R18
SYMATTR Value 10K
SYMBOL res -624 -320 R180
WINDOW 0 36 76 Left 2
WINDOW 3 36 40 Left 2
SYMATTR InstName R14
SYMATTR Value 100K
SYMBOL res -624 -432 R270
WINDOW 0 32 56 VTop 2
WINDOW 3 0 56 VBottom 2
SYMATTR InstName R15
SYMATTR Value 100K
SYMBOL opamp -704 -464 M0
SYMATTR InstName X4
SYMBOL opamp -1296 -416 M0
SYMATTR InstName X5
SYMBOL npn -1168 -336 M0
SYMATTR InstName Q3
SYMATTR Value 2N3904
SYMBOL res -1040 -304 R90
WINDOW 0 0 56 VBottom 2
WINDOW 3 32 56 VTop 2
SYMATTR InstName R19
SYMATTR Value 100K
SYMBOL npn -672 -128 R90
WINDOW 0 6 107 VRight 2
WINDOW 3 38 108 VRight 2
SYMATTR InstName Q1
SYMATTR Value 2N3904
SYMBOL res -512 -176 R90
WINDOW 0 0 56 VBottom 2
WINDOW 3 32 56 VTop 2
SYMATTR InstName R9
SYMATTR Value 100K
SYMBOL cap -176 -160 R90
WINDOW 0 0 32 VBottom 2
WINDOW 3 32 32 VTop 2
SYMATTR InstName C2
SYMATTR Value 1n
SYMBOL res -384 -16 R180
WINDOW 0 36 76 Left 2
WINDOW 3 36 40 Left 2
SYMATTR InstName R12
SYMATTR Value 4.7K
SYMBOL opamp -464 -160 M0
SYMATTR InstName X3
SYMBOL res -272 -256 R90
WINDOW 0 0 56 VBottom 2
WINDOW 3 32 56 VTop 2
SYMATTR InstName R11
SYMATTR Value 10K
SYMBOL res -384 -256 R180
WINDOW 0 36 76 Left 2
WINDOW 3 36 40 Left 2
SYMATTR InstName R10
SYMATTR Value 100K
SYMBOL res -80 -48 R90
WINDOW 0 0 56 VBottom 2
WINDOW 3 32 56 VTop 2
SYMATTR InstName R13
SYMATTR Value 100K
SYMBOL npn -208 -80 M0
SYMATTR InstName Q2
SYMATTR Value 2N3904
TEXT -1456 328 Left 2 ;F = FREQ / (8 * 56K * 1n * 3.3)

noise.asc, the sub-circuit schematic file:
Version 4
SHEET 1 912 680
WIRE -240 16 -240 -16
WIRE -144 16 -144 -16
WIRE 160 16 128 16
WIRE 272 16 240 16
WIRE -16 32 -16 0
WIRE 448 32 416 32
WIRE 560 32 528 32
WIRE -240 144 -240 96
WIRE -144 144 -144 96
WIRE -112 144 -144 144
WIRE -16 144 -16 112
WIRE -16 144 -48 144
WIRE 128 144 128 16
WIRE 128 144 -16 144
WIRE 160 144 128 144
WIRE 272 160 272 16
WIRE 272 160 224 160
WIRE 304 160 272 160
WIRE 416 160 416 32
WIRE 416 160 384 160
WIRE 448 160 416 160
WIRE -16 176 -16 144
WIRE 160 176 128 176
WIRE 560 176 560 32
WIRE 560 176 512 176
WIRE 592 176 560 176
WIRE -144 192 -144 144
WIRE 448 192 416 192
WIRE 128 208 128 176
WIRE 416 224 416 192
WIRE -240 240 -240 208
WIRE -208 240 -240 240
WIRE -16 288 -16 256
WIRE -144 320 -144 288
FLAG -240 -16 VCC
FLAG -16 288 0
FLAG -16 0 VCC
FLAG 128 208 VCC/2
FLAG -144 320 0
FLAG -144 -16 VCC
FLAG 416 224 VCC/2
FLAG 592 176 OUT
IOPIN 592 176 Out
SYMBOL zener -224 208 R180
WINDOW 0 24 64 Left 2
WINDOW 3 24 0 Left 2
SYMATTR InstName D1
SYMATTR Value 1N750
SYMBOL res -224 112 R180
WINDOW 0 36 76 Left 2
WINDOW 3 36 40 Left 2
SYMATTR InstName R1
SYMATTR Value 82K
SYMBOL cap -48 128 R90
WINDOW 0 0 32 VBottom 2
WINDOW 3 32 32 VTop 2
SYMATTR InstName C1
SYMATTR Value 100n
SYMBOL res -32 160 R0
SYMATTR InstName R4
SYMATTR Value 100K
SYMBOL res -32 16 R0
SYMATTR InstName R3
SYMATTR Value 100K
SYMBOL res 256 0 R90
WINDOW 0 0 56 VBottom 2
WINDOW 3 32 56 VTop 2
SYMATTR InstName R5
SYMATTR Value 100K
SYMBOL npn -208 192 R0
SYMATTR InstName Q1
SYMATTR Value 2N3904
SYMBOL res -160 0 R0
SYMATTR InstName R2
SYMATTR Value 1K
SYMBOL res 400 144 R90
WINDOW 0 0 56 VBottom 2
WINDOW 3 32 56 VTop 2
SYMATTR InstName R6
SYMATTR Value 2.2K
SYMBOL res 544 16 R90
WINDOW 0 0 56 VBottom 2
WINDOW 3 32 56 VTop 2
SYMATTR InstName R7
SYMATTR Value 100K
SYMBOL opamp 192 160 R0
SYMATTR InstName X1
SYMBOL opamp 480 176 R0
SYMATTR InstName X2
TEXT -240 376 Left 2 ;No diode model with noise, test is non-functional\nParameters from prototype with LM385BLPE3-1-2

shift_scale.asc, the sub-circuit schematic file:
Version 4
SHEET 1 1260 680
WIRE 64 0 32 0
WIRE 176 0 144 0
WIRE 208 0 176 0
WIRE 320 0 288 0
WIRE 176 160 176 0
WIRE 224 160 176 160
WIRE 320 176 320 0
WIRE 320 176 288 176
WIRE 352 176 320 176
WIRE -32 192 -64 192
WIRE 80 192 48 192
WIRE 192 192 160 192
WIRE 224 192 192 192
WIRE 192 256 192 192
WIRE 192 368 192 336
FLAG -64 192 VCC
FLAG 32 0 SIGNAL
IOPIN 32 0 In
FLAG 192 368 0
FLAG 352 176 OUT
IOPIN 352 176 Out
SYMBOL res 208 352 R180
WINDOW 0 36 76 Left 2
WINDOW 3 36 40 Left 2
SYMATTR InstName R5
SYMATTR Value 180K
SYMBOL res 64 208 R270
WINDOW 0 32 56 VTop 2
WINDOW 3 0 56 VBottom 2
SYMATTR InstName R4
SYMATTR Value 10K
SYMBOL res 304 -16 R90
WINDOW 0 0 56 VBottom 2
WINDOW 3 32 56 VTop 2
SYMATTR InstName R2
SYMATTR Value 10K
SYMBOL res 160 -16 R90
WINDOW 0 0 56 VBottom 2
WINDOW 3 32 56 VTop 2
SYMATTR InstName R1
SYMATTR Value 330K
SYMBOL res 64 176 R90
WINDOW 0 0 56 VBottom 2
WINDOW 3 32 56 VTop 2
SYMATTR InstName R3
SYMATTR Value 82K
SYMBOL opamp 256 176 R0
SYMATTR InstName X1
TEXT 520 0 Left 2 ;Shift/scale [0.0V, 3.3V] to [2.15V, 2.25V]
TEXT 520 40 Left 2 ;shift = 2.2 - 1.65 = 0.55
TEXT 520 80 Left 2 ;scale = 0.1 / 3.3 = 1/33
TEXT 520 120 Left 2 ;R2 / R1 = scale
TEXT 520 160 Left 2 ;(R3 + R4) / R5 =\n  1 - ((2 * shift) / ((1.65 * (1 + scale)) + shift))

ring_modulator.asc, the sub-circuit schematic file:
Version 4
SHEET 1 2340 680
WIRE 1104 -208 480 -208
WIRE 1136 -208 1104 -208
WIRE 1248 -208 1216 -208
WIRE 480 -128 480 -208
WIRE 512 -128 480 -128
WIRE 608 -128 576 -128
WIRE 768 -128 608 -128
WIRE 480 -96 480 -128
WIRE 608 -96 608 -128
WIRE 848 -96 816 -96
WIRE 960 -96 928 -96
WIRE 992 -96 960 -96
WIRE 1104 -96 1104 -208
WIRE 1104 -96 1072 -96
WIRE 1136 -96 1104 -96
WIRE 1248 -80 1248 -208
WIRE 1248 -80 1200 -80
WIRE 1280 -80 1248 -80
WIRE 1136 -64 1104 -64
WIRE 1104 -32 1104 -64
WIRE 480 0 480 -32
WIRE 512 0 480 0
WIRE 608 0 608 -32
WIRE 608 0 576 0
WIRE 816 0 816 -96
WIRE 816 0 608 0
WIRE 848 0 816 0
WIRE 960 16 960 -96
WIRE 960 16 912 16
WIRE 480 32 480 0
WIRE 768 32 768 -128
WIRE 848 32 816 32
WIRE 816 64 816 32
WIRE 224 144 192 144
WIRE 336 144 304 144
WIRE 368 144 336 144
WIRE 480 144 480 112
WIRE 480 144 448 144
WIRE 512 144 480 144
WIRE 624 144 592 144
WIRE 656 144 624 144
WIRE 768 144 768 112
WIRE 768 144 736 144
WIRE 192 256 160 256
WIRE 224 256 192 256
WIRE 336 256 336 144
WIRE 336 256 304 256
WIRE 368 256 336 256
WIRE 480 272 480 144
WIRE 480 272 432 272
WIRE 624 272 624 144
WIRE 624 272 560 272
WIRE 656 272 624 272
WIRE 368 288 336 288
WIRE 768 288 768 144
WIRE 768 288 720 288
WIRE 656 304 624 304
WIRE 336 320 336 288
WIRE 624 336 624 304
WIRE 192 400 192 256
WIRE 224 400 192 400
WIRE 560 400 560 272
WIRE 560 400 304 400
FLAG 336 320 VGND
FLAG 192 144 SIGNAL1
IOPIN 192 144 In
FLAG 624 336 VGND
FLAG 816 64 VGND
FLAG 1104 -32 VGND
FLAG 160 256 SIGNAL2
IOPIN 160 256 In
FLAG 1280 -80 OUT
IOPIN 1280 -80 Out
SYMBOL res 320 128 R90
WINDOW 0 0 56 VBottom 2
WINDOW 3 32 56 VTop 2
SYMATTR InstName R1
SYMATTR Value {r/2}
SYMBOL res 464 128 R90
WINDOW 0 0 56 VBottom 2
WINDOW 3 32 56 VTop 2
SYMATTR InstName R2
SYMATTR Value {r}
SYMBOL res 320 240 R90
WINDOW 0 0 56 VBottom 2
WINDOW 3 32 56 VTop 2
SYMATTR InstName R3
SYMATTR Value {r/2}
SYMBOL res 608 128 R90
WINDOW 0 0 56 VBottom 2
WINDOW 3 32 56 VTop 2
SYMATTR InstName R5
SYMATTR Value {r}
SYMBOL res 752 128 R90
WINDOW 0 0 56 VBottom 2
WINDOW 3 32 56 VTop 2
SYMATTR InstName R6
SYMATTR Value {r}
SYMBOL res 320 384 R90
WINDOW 0 0 56 VBottom 2
WINDOW 3 32 56 VTop 2
SYMATTR InstName R4
SYMATTR Value {r/4}
SYMBOL schottky 592 -96 R0
SYMATTR InstName D1
SYMATTR Value BAT54
SYMBOL schottky 576 -16 R90
WINDOW 0 0 32 VBottom 2
WINDOW 3 32 32 VTop 2
SYMATTR InstName D2
SYMATTR Value BAT54
SYMBOL schottky 496 -32 R180
WINDOW 0 24 64 Left 2
WINDOW 3 24 0 Left 2
SYMATTR InstName D3
SYMATTR Value BAT54
SYMBOL schottky 512 -112 R270
WINDOW 0 32 32 VTop 2
WINDOW 3 0 32 VBottom 2
SYMATTR InstName D4
SYMATTR Value BAT54
SYMBOL res 496 128 R180
WINDOW 0 36 76 Left 2
WINDOW 3 36 40 Left 2
SYMATTR InstName R7
SYMATTR Value {r}
SYMBOL res 784 128 R180
WINDOW 0 36 76 Left 2
WINDOW 3 36 40 Left 2
SYMATTR InstName R8
SYMATTR Value {r}
SYMBOL res 832 -80 R270
WINDOW 0 32 56 VTop 2
WINDOW 3 0 56 VBottom 2
SYMATTR InstName R9
SYMATTR Value {r}
SYMBOL res 976 -80 R270
WINDOW 0 32 56 VTop 2
WINDOW 3 0 56 VBottom 2
SYMATTR InstName R10
SYMATTR Value {r}
SYMBOL res 1120 -192 R270
WINDOW 0 32 56 VTop 2
WINDOW 3 0 56 VBottom 2
SYMATTR InstName R11
SYMATTR Value {r}
SYMBOL opamp 400 272 R0
SYMATTR InstName X1
SYMBOL opamp 688 288 R0
SYMATTR InstName X2
SYMBOL opamp 880 16 R0
SYMATTR InstName X3
SYMBOL opamp 1168 -80 R0
SYMATTR InstName X4
TEXT 152 -80 Left 2 !.param r 3K
TEXT 888 216 Left 2 ;X1 out: -(SIGNAL2 + SIGNAL1)
TEXT 888 256 Left 2 ;X2 out: -(SIGNAL2 - SIGNAL1)
TEXT 888 336 Left 2 ;D2 + X3: when -(SIGNAL2 + SIGNAL1) < 0, X3 out: (SIGNAL2 + SIGNAL1)^2
TEXT 888 296 Left 2 ;D1 + X3: when -(SIGNAL2 - SIGNAL1) > 0, X3 out: -(SIGNAL2 - SIGNAL1)^2
TEXT 888 376 Left 2 ;D3 + X4: when -(SIGNAL2 + SIGNAL1) > 0, X4 out: -(SIGNAL2 + SIGNAL1)^2 - U3 out
TEXT 888 416 Left 2 ;D4 + X4: when -(SIGNAL2 - SIGNAL1) < 0, X4 out: (SIGNAL2 - SIGNAL1)^2 - U3 out

switch2_0.1v.asc, the sub-circuit schematic file:
Version 4
SHEET 1 1676 680
WIRE 592 -64 560 -64
WIRE 592 -32 592 -64
WIRE 592 64 592 48
WIRE 544 80 400 80
WIRE 864 96 736 96
WIRE 736 160 736 96
WIRE 768 160 736 160
WIRE 864 176 864 96
WIRE 864 176 832 176
WIRE 896 176 864 176
WIRE 288 192 256 192
WIRE 400 192 400 80
WIRE 400 192 368 192
WIRE 592 192 592 160
WIRE 736 192 592 192
WIRE 768 192 736 192
WIRE 592 224 592 192
WIRE 736 224 736 192
WIRE 400 304 400 192
WIRE 544 304 400 304
WIRE 736 320 736 288
WIRE 592 336 592 320
WIRE 592 448 592 416
WIRE 592 448 560 448
FLAG 560 -64 SIGNAL1
IOPIN 560 -64 In
FLAG 560 448 SIGNAL2
IOPIN 560 448 In
FLAG 256 192 SELECT
IOPIN 256 192 In
FLAG 896 176 OUT
IOPIN 896 176 Out
FLAG 736 320 0
SYMBOL nmos 544 224 R0
SYMATTR InstName M1
SYMATTR Value AO6408
SYMBOL pmos 544 160 M180
SYMATTR InstName M2
SYMATTR Value AO6407
SYMBOL cap 720 288 M180
WINDOW 0 24 56 Left 2
WINDOW 3 24 8 Left 2
SYMATTR InstName C1
SYMATTR Value 10n
SYMBOL res 576 -48 R0
SYMATTR InstName R9
SYMATTR Value 470
SYMBOL res 576 320 R0
SYMATTR InstName R10
SYMATTR Value 470
SYMBOL opamp 800 176 R0
WINDOW 0 9 -34 Left 2
SYMATTR InstName X1
SYMBOL res 384 176 R90
WINDOW 0 0 56 VBottom 2
WINDOW 3 32 56 VTop 2
SYMATTR InstName R1
SYMATTR Value 4.7K

switch4_0.1v.asc, the sub-circuit schematic file:
Version 4
SHEET 1 1676 680
WIRE 848 -144 816 -144
WIRE 848 -112 848 -144
WIRE 592 -64 560 -64
WIRE 1136 -64 1104 -64
WIRE 592 -32 592 -64
WIRE 1104 -32 1104 -64
WIRE 848 0 848 -32
WIRE 848 0 736 0
WIRE 960 0 848 0
WIRE 592 64 592 48
WIRE 1104 64 1104 48
WIRE 544 80 400 80
WIRE 1296 80 1152 80
WIRE 736 144 736 0
WIRE 960 144 960 0
WIRE 288 192 256 192
WIRE 400 192 400 80
WIRE 400 192 368 192
WIRE 592 192 592 160
WIRE 720 192 592 192
WIRE 848 192 816 192
WIRE 880 192 848 192
WIRE 1104 192 1104 160
WIRE 1104 192 976 192
WIRE 1296 192 1296 80
WIRE 1328 192 1296 192
WIRE 1440 192 1408 192
WIRE 592 224 592 192
WIRE 1104 224 1104 192
WIRE 400 304 400 192
WIRE 544 304 400 304
WIRE 1296 304 1296 192
WIRE 1296 304 1152 304
WIRE 592 336 592 320
WIRE 1104 336 1104 320
WIRE 992 400 880 400
WIRE 592 448 592 416
WIRE 592 448 560 448
WIRE 1104 448 1104 416
WIRE 1136 448 1104 448
WIRE 880 464 880 400
WIRE 912 464 880 464
WIRE 992 480 992 400
WIRE 992 480 976 480
WIRE 1024 480 992 480
WIRE 752 496 720 496
WIRE 848 496 848 192
WIRE 848 496 816 496
WIRE 912 496 848 496
WIRE 720 528 720 496
FLAG 560 -64 SIGNAL1
IOPIN 560 -64 In
FLAG 560 448 SIGNAL2
IOPIN 560 448 In
FLAG 256 192 SELECT1
IOPIN 256 192 In
FLAG 816 -144 SELECT2
IOPIN 816 -144 In
FLAG 1024 480 OUT
IOPIN 1024 480 Out
FLAG 720 528 0
FLAG 1136 -64 SIGNAL3
IOPIN 1136 -64 In
FLAG 1136 448 SIGNAL4
IOPIN 1136 448 In
FLAG 1440 192 SELECT1
IOPIN 1440 192 In
SYMBOL nmos 544 224 R0
SYMATTR InstName M1
SYMATTR Value AO6408
SYMBOL pmos 544 160 M180
SYMATTR InstName M2
SYMATTR Value AO6407
SYMBOL cap 816 480 R90
WINDOW 0 0 32 VBottom 2
WINDOW 3 32 32 VTop 2
SYMATTR InstName C1
SYMATTR Value 10n
SYMBOL res 576 -48 R0
SYMATTR InstName R9
SYMATTR Value 470
SYMBOL res 576 320 R0
SYMATTR InstName R10
SYMATTR Value 470
SYMBOL pmos 816 144 R90
WINDOW 0 71 63 VLeft 2
WINDOW 3 104 88 VLeft 2
SYMATTR InstName M4
SYMATTR Value AO6407
SYMBOL nmos 880 144 M90
WINDOW 0 74 30 VRight 2
WINDOW 3 108 5 VRight 2
SYMATTR InstName M3
SYMATTR Value AO6408
SYMBOL nmos 1152 224 M0
SYMATTR InstName M5
SYMATTR Value AO6408
SYMBOL pmos 1152 160 R180
SYMATTR InstName M6
SYMATTR Value AO6407
SYMBOL res 1120 64 R180
WINDOW 0 36 76 Left 2
WINDOW 3 36 40 Left 2
SYMATTR InstName R6
SYMATTR Value 470
SYMBOL res 1120 432 R180
WINDOW 0 36 76 Left 2
WINDOW 3 36 40 Left 2
SYMATTR InstName R11
SYMATTR Value 370
SYMBOL opamp 944 480 R0
WINDOW 0 9 -34 Left 2
SYMATTR InstName X1
SYMBOL res 384 176 R90
WINDOW 0 0 56 VBottom 2
WINDOW 3 32 56 VTop 2
SYMATTR InstName R1
SYMATTR Value 4.7K
SYMBOL res 1424 176 R90
WINDOW 0 0 56 VBottom 2
WINDOW 3 32 56 VTop 2
SYMATTR InstName R2
SYMATTR Value 4.7K
SYMBOL res 832 -128 R0
SYMATTR InstName R3
SYMATTR Value 4.7K

The netlist it stands for:
* test_toplevel.asc
V1 VCC 0 3.3
V3 VGND 0 2.2
R1 0 N018 10K
XX34 N009 N016 N021 N023 N017 mixer
R2 0 N045 10K
XX36 N017 N018 NC_01 line_driver
XX37 N044 N045 NC_02 line_driver
V4 VCC/2 0 1.65
XX26 NC_03 N008 N009 attenuator
XX27 NC_04 N013 N016 attenuator
XX28 NC_05 N026 N021 attenuator
XX29 NC_06 N030 N023 attenuator
XX35 N037 N043 N048 N050 N044 mixer
XX30 NC_07 N008 N037 attenuator
XX31 NC_08 N013 N043 attenuator
XX32 NC_09 N026 N048 attenuator
XX33 NC_10 N030 N050 attenuator
XX18 N003 NC_11 NC_12 N015 N014 N011 filter
XX19 N020 NC_13 NC_14 N029 N028 N027 filter
XX20 N032 NC_15 NC_16 N042 N041 N039 filter
XX21 N047 NC_17 NC_18 N055 N054 N053 filter
XX6 NC_19 NC_20 N004 N005 N006 N001 N007 switch4_3.3v
XX7 NC_21 NC_22 N019 N022 N024 N001 N025 switch4_3.3v
XX8 NC_23 NC_24 N033 N034 N035 N001 N036 switch4_3.3v
XX9 NC_25 NC_26 N046 N049 N051 N001 N052 switch4_3.3v
XX1 NC_27 NC_28 N004 N005 N006 NC_29 N012 NC_30 oscillator
XX2 NC_31 NC_32 N019 N022 N024 NC_33 NC_34 N012 oscillator
XX3 NC_35 NC_36 N033 N034 N035 NC_37 N040 NC_38 oscillator
XX4 NC_39 NC_40 N046 N049 N051 NC_41 NC_42 N040 oscillator
XX5 N001 noise
XX10 N007 N002 shift_scale
XX11 N025 N020 shift_scale
XX12 N036 N031 shift_scale
XX13 N052 N047 shift_scale
XX14 N002 N013 N010 ring_modulator
XX15 N031 N030 N038 ring_modulator
XX16 NC_43 N002 N010 N003 switch2_0.1v
XX17 NC_44 N031 N038 N032 switch2_0.1v
XX22 NC_45 N003 N011 N008 N014 N015 NC_46 switch4_0.1v
XX23 NC_47 N020 N027 N013 N028 N029 NC_48 switch4_0.1v
XX24 NC_49 N032 N039 N026 N041 N042 NC_50 switch4_0.1v
XX25 NC_51 N047 N053 N030 N054 N055 NC_52 switch4_0.1v

* block symbol definitions
.subckt mixer SIGNAL1 SIGNAL2 SIGNAL3 SIGNAL4 OUT
R1 N001 SIGNAL1 100K
R2 N001 SIGNAL2 100K
R3 N001 SIGNAL3 100K
R4 N001 SIGNAL4 100K
XX1 VGND N001 OUT opamp
R5 OUT N001 300K
.ends mixer

.subckt opamp IN+ IN- OUT
XU1 IN+ IN- VCC 0 OUT level.2 Avol=1Meg GBW=1.2Meg Slew=10Meg ilimit=25m rail=0 Vos=0 phimargin=45 en=0 enk=0 in=0 ink=0 Rin=500Meg  ; pins IN+ IN- V+ V- OUT
.ends opamp

.subckt line_driver SIGNAL OUT ON
R2 OUT N003 1K
D1 OUT 0 1N4148
D2 0 OUT 1N4148
C1 SIGNAL N002 1µ
R1 ON N001 100K
M1 N002 N001 N003 N003 2N7002
.ends line_driver

.subckt attenuator GAIN SIGNAL OUT
R6 OUT N001 1K
R8 VGND N002 1K
J2 N002 VGND VGND 2SK3557
J1 N001 N005 VGND 2SK3557
R5 N001 SIGNAL 1K
R7 N002 SIGNAL 1K
R9 N005 N004 100K
R4 N006 0 100K
R3 N006 VCC 85.6K
R2 N004 N003 100K
R1 N003 GAIN 421K
XX2 N002 N001 OUT opamp
XX1 N006 N003 N004 opamp
* Calibrate J1 gate voltage VG for 50mVpp output @100mVpp input
* Shift/scale/invert [0, VCC] to [VGND, VG]:
* For SPICE simulation VG = 1.416V
* scale = (VGND - VG) / VCC = 0.238 (SPICE)
* R1/R2 = 1 / scale
* R3/R4 = (scale + 1) * (VCC/VGND) - 1
.ends attenuator

.subckt filter SIGNAL CUTOFF RESON BAND HIGH LOW
C1 BAND N002 0.5µ
C2 LOW N003 0.5µ
R3 HIGH N001 100K
R2 LOW N001 100K
R1 N001 SIGNAL 100K
XX4 N004 N001 HIGH opamp
XX5 VGND N002 BAND opamp
XX6 VGND N003 LOW opamp
R4 N005 N004 1K
XX1 N004 VGND RESON jfet_1k_100
XX2 HIGH N002 CUTOFF jfet_1k_100
XX3 BAND N003 CUTOFF jfet_1k_100
R5 BAND N005 390
* Gain(low) = -R2/R1
* Gain(high) = -R3/R1
* If R2=R3 R(X2)=R(X3) C1=C2:
* Fcenter = 1/(2*PI*R(X2)*C1)
* Q = (R4+R5)/(R(X1)*2)
* Qmin = 0.707
* Qmax = 7
* R(X1) = 1K
* R(X1) = 100
.ends filter

.subckt jfet_1k_100 DRAIN SOURCE CONTROL
R1 N002 VCC 118.6K
R2 N003 N002 100K
R3 N005 CONTROL 142.1K
R4 N005 VCC/2 10K
R5 N004 N003 1Meg
J1 DRAIN N004 SOURCE 2SK3557
R6 N001 N004 1Meg
XX1 N005 N002 N003 opamp
XX2 DRAIN N001 N001 opamp
* Calibrate R5 input voltage VR5 for 100 and 1K ohms @100mVpp input
* For SPICE simulation:
* shift = (VR5(max) + VR5(min) - VCC) / 2 = -1.391 (SPICE)
* Shift/scale/invert [0, VCC] to [VR5(max), VR5(min)]:
* scale = (VR5(max) - VR5(min)) / VCC = 0.121 (SPICE)
* R1/R2 = -VCC / (shift * 2)
* R3/R4 = ((VCC/2 - shift) / (VCC/2 * scale)) - 1
* VR5(max) = 459mV (100 ohm)
* VR5(min) = 59mV (1K ohm)
.ends jfet_1k_100

.subckt switch4_3.3v SELECT1 SELECT2 SIGNAL1 SIGNAL2 SIGNAL3 SIGNAL4 OUT
R1 N002 N001 470
R2 N002 N003 470
R3 N005 N004 470
R4 N005 N006 470
XX1 SELECT1 SIGNAL1 N001 switch_off_3.3v
XX2 SELECT1 SIGNAL2 N003 switch_on_3.3v
XX3 SELECT1 SIGNAL3 N004 switch_off_3.3v
XX4 SELECT1 SIGNAL4 N006 switch_on_3.3v
XX5 SELECT2 N002 OUT switch_off_3.3v
XX6 SELECT2 N005 OUT switch_on_3.3v
C1 OUT 0 1p
.ends switch4_3.3v

.subckt switch_off_3.3v CONTROL SIGNAL OUT
R2 N001 VCC 100K
Q1 N001 N004 0 0 2N3904
R1 N004 CONTROL 100K
Q2 OUT N002 SIGNAL 0 2N3904
Q3 OUT N003 SIGNAL 0 2N3906
R4 N003 CONTROL 100K
R3 N002 N001 100K
.ends switch_off_3.3v

.subckt switch_on_3.3v CONTROL SIGNAL OUT
Q3 OUT N004 SIGNAL 0 2N3904
R4 CONTROL N004 100K
Q2 OUT N003 SIGNAL 0 2N3906
R2 0 N002 100K
R1 N001 CONTROL 100K
Q1 N002 N001 VCC 0 2N3906
R3 N003 N002 100K
.ends switch_on_3.3v

.subckt oscillator FREQ DUTY TRI PULSE SAW SYNC_DIS SYNC_IN SYNC_OUT
R2 N015 N012 56K
R6 N006 SYNC_OUT 2.2K
R7 VCC/2 N006 100K
R3 N012 N014 56K
C1 TRI N012 1n
R5 N016 0 100K
R4 FREQ N016 100K
M1 N014 N011 0 0 2N7002
R21 N017 DUTY 4.7K
R20 VCC/2 N017 100K
R8 N011 SYNC_OUT 4.7K
R22 PULSE N017 1Meg
R1 FREQ N015 56K
XX2 N006 TRI SYNC_OUT opamp
XX6 N017 TRI PULSE opamp
XX1 N016 N012 TRI opamp
R17 N001 SAW 100K
R16 N002 N001 100K
R18 N002 N004 10K
R14 TRI N003 100K
R15 N003 VCC 100K
XX4 N003 N002 N002 opamp
XX5 N004 N001 SAW opamp
Q3 N004 N005 VCC/2_COMP 0 2N3904
R19 SYNC_OUT N005 100K
Q1 TRI N008 N012 0 2N3904
R9 N009 N008 100K
C2 SYNC_IN N010 1n
R12 0 N010 4.7K
XX3 N010 N007 N009 opamp
R11 0 N007 10K
R10 N007 VCC 100K
R13 SYNC_DIS N013 100K
Q2 N010 N013 0 0 2N3904
* F = FREQ / (8 * 56K * 1n * 3.3)
.ends oscillator

.subckt noise OUT
D1 N006 N004 1N750
R1 N004 VCC 82K
C1 N001 N005 100n
R4 N001 0 100K
R3 VCC N001 100K
R5 N002 N001 100K
Q1 N005 N006 0 0 2N3904
R2 VCC N005 1K
R6 N003 N002 2.2K
R7 OUT N003 100K
XX1 VCC/2 N001 N002 opamp
XX2 VCC/2 N003 OUT opamp
* No diode model with noise, test is non-functional
* Parameters from prototype with LM385BLPE3-1-2
.ends noise

.subckt shift_scale SIGNAL OUT
R5 0 N003 180K
R4 N002 N003 10K
R2 OUT N001 10K
R1 N001 SIGNAL 330K
R3 N002 VCC 82K
XX1 N003 N001 OUT opamp
* Shift/scale [0.0V, 3.3V] to [2.15V, 2.25V]
* shift = 2.2 - 1.65 = 0.55
* scale = 0.1 / 3.3 = 1/33
* R2 / R1 = scale
* (R3 + R4) / R5 =
*   1 - ((2 * shift) / ((1.65 * (1 + scale)) + shift))
.ends shift_scale

.subckt ring_modulator SIGNAL1 SIGNAL2 OUT
R1 N006 SIGNAL1 {r/2}
R2 N007 N006 {r}
R3 N006 SIGNAL2 {r/2}
R5 N008 N007 {r}
R6 N009 N008 {r}
R4 N008 SIGNAL2 {r/4}
D1 N002 N003 BAT54
D2 N003 N005 BAT54
D3 N005 N001 BAT54
D4 N001 N002 BAT54
R7 N007 N005 {r}
R8 N009 N002 {r}
R9 N003 N004 {r}
R10 N004 N001 {r}
R11 N001 OUT {r}
XX1 VGND N006 N007 opamp
XX2 VGND N008 N009 opamp
XX3 VGND N003 N004 opamp
XX4 VGND N001 OUT opamp
.param r 3K
* X1 out: -(SIGNAL2 + SIGNAL1)
* X2 out: -(SIGNAL2 - SIGNAL1)
* D2 + X3: when -(SIGNAL2 + SIGNAL1) < 0, X3 out: (SIGNAL2 + SIGNAL1)^2
* D1 + X3: when -(SIGNAL2 - SIGNAL1) > 0, X3 out: -(SIGNAL2 - SIGNAL1)^2
* D3 + X4: when -(SIGNAL2 + SIGNAL1) > 0, X4 out: -(SIGNAL2 + SIGNAL1)^2 - U3 out
* D4 + X4: when -(SIGNAL2 - SIGNAL1) < 0, X4 out: (SIGNAL2 - SIGNAL1)^2 - U3 out
.ends ring_modulator

.subckt switch2_0.1v SELECT SIGNAL1 SIGNAL2 OUT
M1 N003 N002 N004 N004 AO6408
M2 N003 N002 N001 N001 AO6407
C1 0 N003 10n
R9 SIGNAL1 N001 470
R10 N004 SIGNAL2 470
XX1 N003 OUT OUT opamp
R1 N002 SELECT 4.7K
.ends switch2_0.1v

.subckt switch4_0.1v SELECT1 SIGNAL1 SIGNAL2 OUT SIGNAL3 SIGNAL4 SELECT2
M1 N006 N004 N009 N009 AO6408
M2 N006 N004 N002 N002 AO6407
C1 N007 0 10n
R9 SIGNAL1 N002 470
R10 N009 SIGNAL2 470
M4 N007 N001 N006 N006 AO6407
M3 N007 N001 N008 N008 AO6408
M5 N008 N005 N010 N010 AO6408
M6 N008 N005 N003 N003 AO6407
R6 N003 SIGNAL3 470
R11 SIGNAL4 N010 370
XX1 N007 OUT OUT opamp
R1 N004 SELECT1 4.7K
R2 SELECT1 N005 4.7K
R3 SELECT2 N001 4.7K
.ends switch4_0.1v

.model D D
.lib standard.dio
.model NPN NPN
.model PNP PNP
.lib standard.bjt
.model NJF NJF
.model PJF PJF
.lib standard.jft
.model NMOS NMOS
.model PMOS PMOS
.lib standard.mos
* For reference only, simulation not wired up
.lib UniversalOpamps2.sub
.backanno
.end